# EAGLE design GuardDog (EAGLE 6.2)
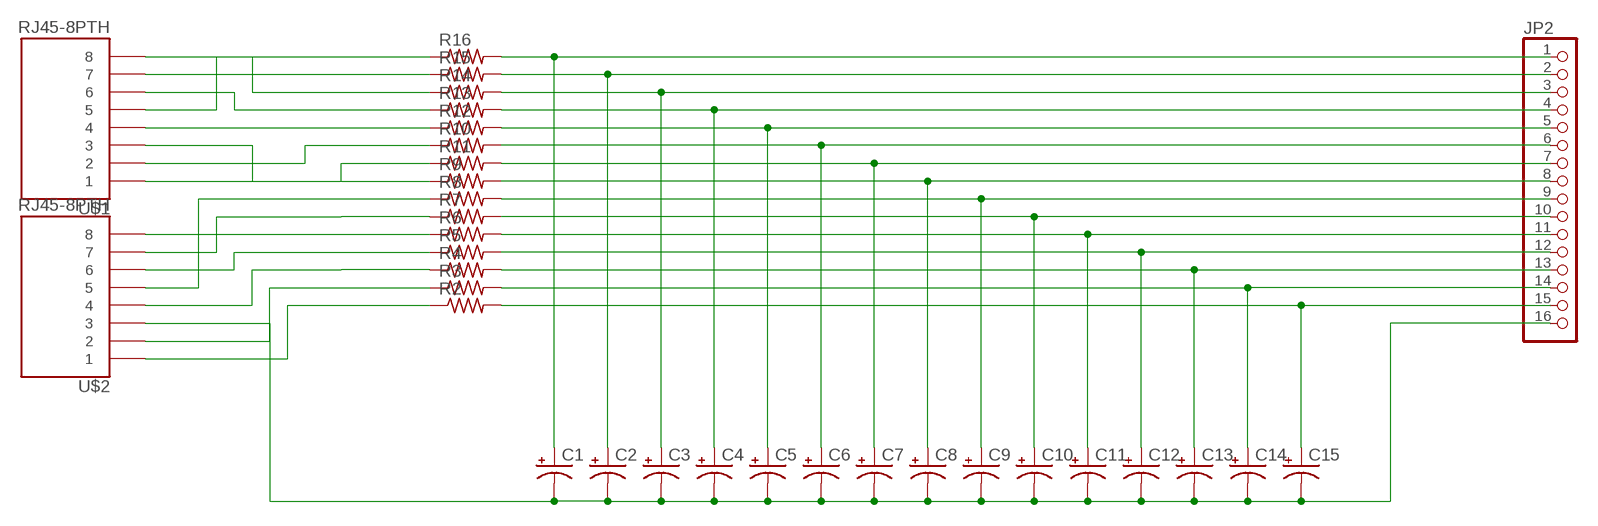
[diagram p0: schematic, sheet 1]

## Parts
C1  CAP_POLPTH2  [CPOL-RADIAL-10UF-25V]
C2  CAP_POLPTH2  [CPOL-RADIAL-10UF-25V]
C3  CAP_POLPTH2  [CPOL-RADIAL-10UF-25V]
C4  CAP_POLPTH2  [CPOL-RADIAL-10UF-25V]
C5  CAP_POLPTH2  [CPOL-RADIAL-10UF-25V]
C6  CAP_POLPTH2  [CPOL-RADIAL-10UF-25V]
C7  CAP_POLPTH2  [CPOL-RADIAL-10UF-25V]
C8  CAP_POLPTH2  [CPOL-RADIAL-10UF-25V]
C9  CAP_POLPTH2  [CPOL-RADIAL-10UF-25V]
C10  CAP_POLPTH2  [CPOL-RADIAL-10UF-25V]
C11  CAP_POLPTH2  [CPOL-RADIAL-10UF-25V]
C12  CAP_POLPTH2  [CPOL-RADIAL-10UF-25V]
C13  CAP_POLPTH2  [CPOL-RADIAL-10UF-25V]
C14  CAP_POLPTH2  [CPOL-RADIAL-10UF-25V]
C15  CAP_POLPTH2  [CPOL-RADIAL-10UF-25V]
JP2  PINHD-1X16  [1X16]
R2  R-US_0204/5  [0204/5]
R3  R-US_0204/5  [0204/5]
R4  R-US_0204/5  [0204/5]
R5  R-US_0204/5  [0204/5]
R6  R-US_0204/5  [0204/5]
R7  R-US_0204/5  [0204/5]
R8  R-US_0204/5  [0204/5]
R9  R-US_0204/5  [0204/5]
R10  R-US_0204/5  [0204/5]
R11  R-US_0204/5  [0204/5]
R12  R-US_0204/5  [0204/5]
R13  R-US_0204/5  [0204/5]
R14  R-US_0204/5  [0204/5]
R15  R-US_0204/5  [0204/5]
R16  R-US_0204/5  [0204/5]
U$1  RJ45-8PTH  [RJ45-8]
U$2  RJ45-8PTH  [RJ45-8]

## Nets
N$1: R15.1 U$1.7
N$2: C2.1(+) JP2.2 R15.2
N$3: R16.1 U$1.5
N$4: C1.1(+) JP2.1 R16.2
N$5: R14.1 U$1.8
N$6: C3.1(+) JP2.3 R14.2
N$7: R13.1 U$1.6
N$8: C4.1(+) JP2.4 R13.2
N$9: R12.1 U$1.4
N$10: C5.1(+) JP2.5 R12.2
N$11: C6.1(+) JP2.6 R10.2
N$12: R10.1 U$1.2
N$14: C7.1(+) JP2.7 R11.2
N$15: C8.1(+) JP2.8 R9.2
N$16: R9.1 U$1.3
N$17: R8.1 U$2.5
N$18: R7.1 U$2.7
N$19: R6.1 U$2.8
N$20: R4.1 U$2.4
N$21: R5.1 U$2.6
N$22: R3.1 U$2.2
N$23: R2.1 U$2.1
N$25: C9.1(+) JP2.9 R8.2
N$26: C10.1(+) JP2.10 R7.2
N$27: C11.1(+) JP2.11 R6.2
N$28: C12.1(+) JP2.12 R5.2
N$29: C13.1(+) JP2.13 R4.2
N$30: C14.1(+) JP2.14 R3.2
N$31: C15.1(+) JP2.15 R2.2
N$34: R11.1 U$1.1
N$36: C1.2(-) C2.2(-) C3.2(-) C4.2(-) C5.2(-) C6.2(-) C7.2(-) C8.2(-) C9.2(-) C10.2(-) C11.2(-) C12.2(-) C13.2(-) C14.2(-) C15.2(-) JP2.16 U$2.3

## Library data of the parts
C1-C15 = SparkFun:CAP_POL: Capacitor Polarized These are standard SMD and PTH capacitors. Normally 10uF, 47uF, and 100uF in electrolytic and tantalum varieties. Always verify the external diameter of the through hole cap, it varies with capacity, voltage, and manufacturer. The EIA devices should be standard.
JP2 = pinhead:PINHD-1X16: PIN HEADER
R2-R16 = resistor:R-US_: RESISTOR, American symbol
U$1 U$2 = SparkFun:RJ45-8: RJ45 Jack Simple RJ45, 8-pin connection - connector for common Cat5, Cat5e, and Cat6 Ethernet cables. Footprint not yet proven in production. Connector sku is PRT-00643; Breakout PCB sku is BOB-00716.

## Net classes
0 default: width 0.203 mm

## Board
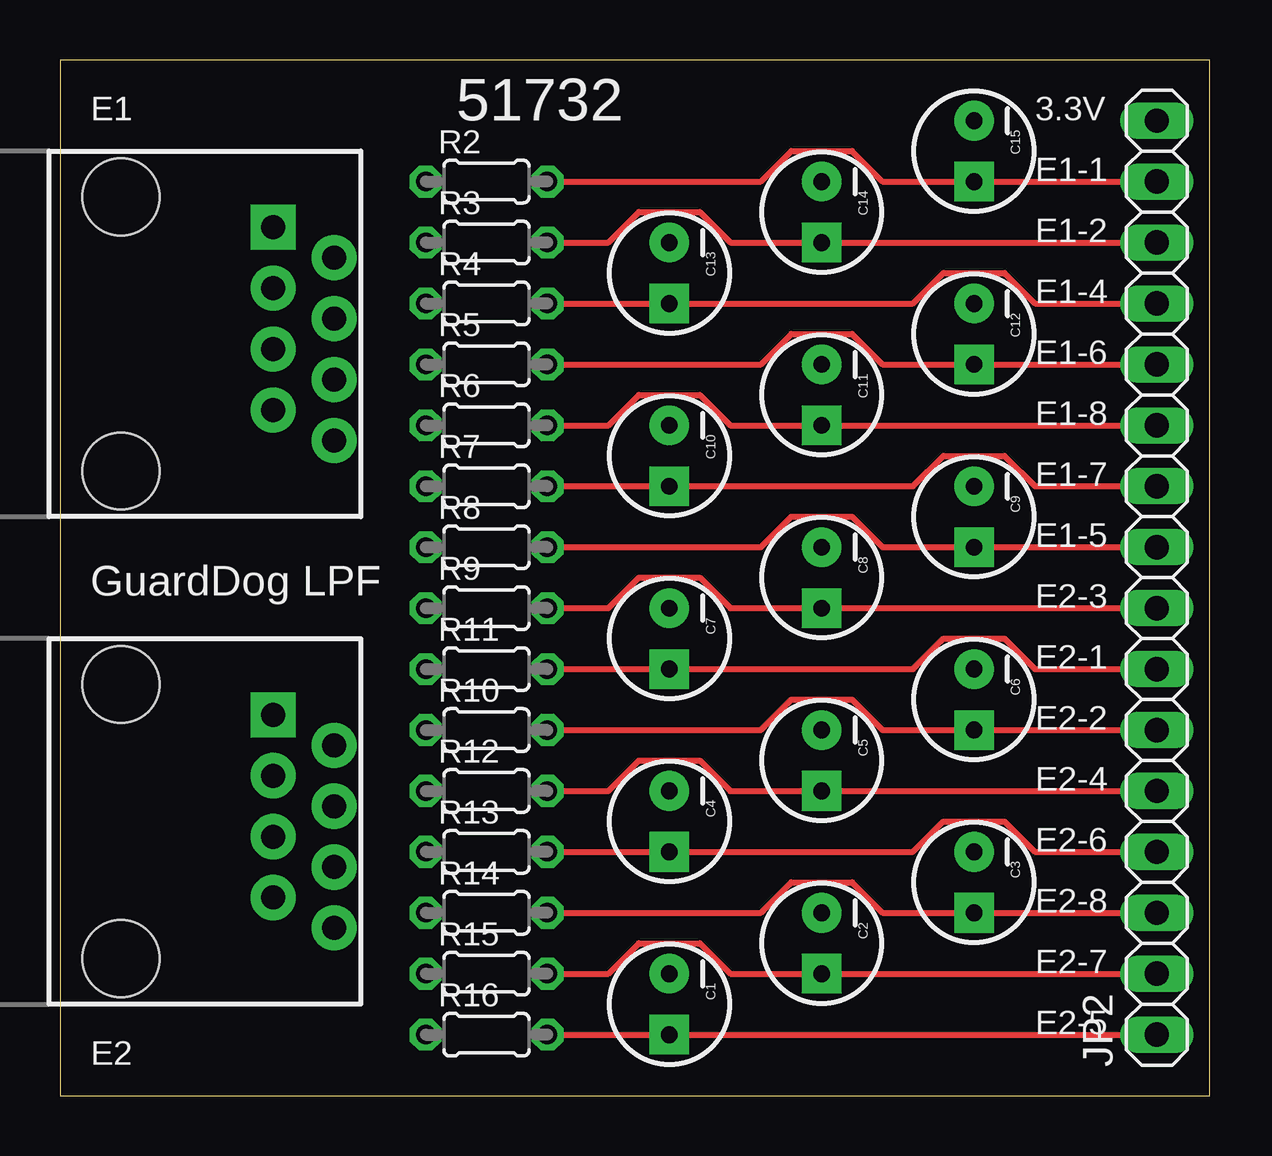
[diagram p1: board, top side]
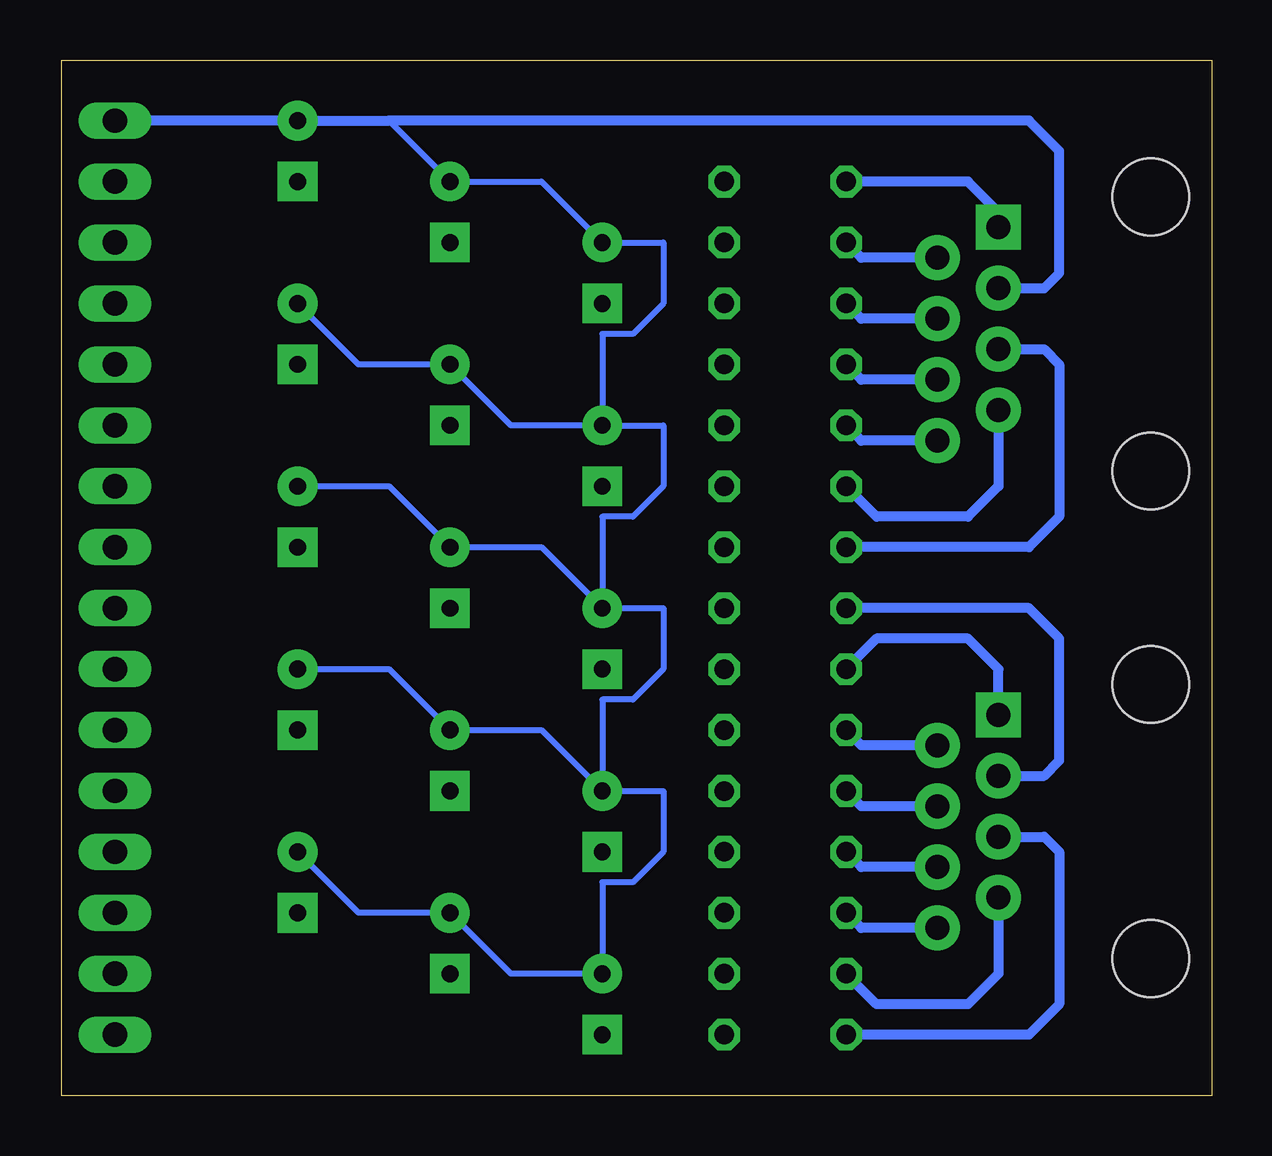
[diagram p2: board, bottom side, seen from below]

Size 47.93 x 43.17 mm. Coordinates in mm from the lower left corner, seen from the top.
Outline: 0,0 47.93,0 47.93,43.17 0,43.17 0,0
Copper layers (1*16): Top 0.035mm / dielectric 1.5mm / Bottom 0.035mm
Design rules: minimum track width 6mil, minimum drill 12mil, track to track 6mil, track to pad 6mil, pad to pad 6mil, via to via 6mil, smd to smd 0mil, copper to edge 10mil, drill to drill 10mil, minimum pad ring 10mil, minimum via ring 6mil, stop-mask expansion 2mil, vias tented up to drill 100mil, thermal gap 10mil

### Footprints (pad centres in the part's own frame; a part is rotated, then mirrored left to right if it is on the bottom)
CPOL-RADIAL-10UF-25V = drill 0.7 pad 1.651 square: 1 1.27,0 | drill 0.7 pad 1.651: 2 -1.27,0
1X16 = drill 1.016 long: 1 -19.05,0; 2 -16.51,0; 3 -13.97,0; 4 -11.43,0; 5 -8.89,0; 6 -6.35,0; 7 -3.81,0; 8 -1.27,0; 9 1.27,0; 10 3.81,0; 11 6.35,0; 12 8.89,0; 13 11.43,0; 14 13.97,0; 15 16.51,0; 16 19.05,0
0204/5 = drill 0.813 octagon: 1 -2.54,0; 2 2.54,0
RJ45-8 = drill 1 pad 1.88 square: 1 -4.445,6.35 | drill 1 pad 1.88: 2 -3.175,8.89; 3 -1.905,6.35; 4 -0.635,8.89; 5 0.635,6.35; 6 1.905,8.89; 7 3.175,6.35; 8 4.445,8.89 | hole 3.2: -5.715,0; 5.715,0

### Placement (x,y rotation side)
C1  25.4,3.81 270 top
C2  31.75,6.35 270 top
C3  38.1,8.89 270 top
C4  25.4,11.43 270 top
C5  31.75,13.97 270 top
C6  38.1,16.51 270 top
C7  25.4,19.05 270 top
C8  31.75,21.59 270 top
C9  38.1,24.13 270 top
C10  25.4,26.67 270 top
C11  31.75,29.21 270 top
C12  38.1,31.75 270 top
C13  25.4,34.29 270 top
C14  31.75,36.83 270 top
C15  38.1,39.37 270 top
JP2  45.72,21.59 90 top
R2  17.78,38.1 0 top
R3  17.78,35.56 0 top
R4  17.78,33.02 0 top
R5  17.78,30.48 0 top
R6  17.78,27.94 0 top
R7  17.78,25.4 0 top
R8  17.78,22.86 0 top
R9  17.78,20.32 0 top
R10  17.78,15.24 0 top
R11  17.78,17.78 0 top
R12  17.78,12.7 0 top
R13  17.78,10.16 0 top
R14  17.78,7.62 0 top
R15  17.78,5.08 0 top
R16  17.78,2.54 0 top
U$1  2.54,11.43 270 top
U$2  2.54,31.75 270 top

### Tracks (layer width: path | path; a pad name or v marks a point on that pad's centre or on a via)
N$1
  Bottom 0.406: U$1.7 8.89,5.08 10.16,3.81 13.97,3.81 R15.1
N$2
  Top 0.254: R15.2 22.86,5.08 24.13,6.35 26.67,6.35 27.94,5.08 C2.1 JP2.2
N$3
  Bottom 0.406: U$1.5 6.99,10.79 6.35,10.16 6.35,3.81 7.62,2.54 R16.1
N$4
  Top 0.254: R16.2 C1.1 JP2.1 46.99,2.54
N$5
  Bottom 0.406: U$1.8 14.61,6.98 R14.1
N$6
  Top 0.254: R14.2 29.21,7.62 30.48,8.89 33.02,8.89 34.29,7.62 C3.1 JP2.3
N$7
  Bottom 0.406: U$1.6 14.61,9.52 R13.1
N$8
  Top 0.254: R13.2 C4.1 35.56,10.16 36.83,11.43 39.37,11.43 40.64,10.16 JP2.4
N$9
  Bottom 0.406: U$1.4 14.61,12.06 R12.1
N$10
  Top 0.254: R12.2 22.86,12.7 24.13,13.97 26.67,13.97 27.94,12.7 C5.1 JP2.5
N$11
  Top 0.254: R10.2 29.21,15.24 30.48,16.51 33.02,16.51 34.29,15.24 C6.1 JP2.6 46.99,15.24
N$12
  Bottom 0.406: U$1.2 14.61,14.6 R10.1
N$14
  Top 0.254: 46.99,17.78 JP2.7 40.64,17.78 39.37,19.05 36.83,19.05 35.56,17.78 C7.1 R11.2
N$15
  Top 0.254: R9.2 22.86,20.32 24.13,21.59 26.67,21.59 27.94,20.32 C8.1 JP2.8
N$16
  Bottom 0.406: U$1.3 6.99,13.34 6.35,13.97 6.35,19.05 7.62,20.32 R9.1
N$17
  Bottom 0.406: U$2.5 6.99,31.11 6.35,30.48 6.35,24.13 7.62,22.86 R8.1
N$18
  Bottom 0.406: U$2.7 8.89,25.4 10.16,24.13 13.97,24.13 R7.1
N$19
  Bottom 0.406: U$2.8 14.61,27.3 R6.1
N$20
  Bottom 0.406: U$2.4 14.61,32.38 R4.1
N$21
  Bottom 0.406: U$2.6 14.61,29.84 R5.1
N$22
  Bottom 0.406: U$2.2 14.61,34.92 R3.1
N$23
  Bottom 0.406: U$2.1 8.89,36.83 10.16,38.1 R2.1
N$25
  Top 0.254: R8.2 29.21,22.86 30.48,24.13 33.02,24.13 34.29,22.86 C9.1 JP2.9
N$26
  Top 0.254: R7.2 C10.1 35.56,25.4 36.83,26.67 39.37,26.67 40.64,25.4 JP2.10
N$27
  Top 0.254: R6.2 22.86,27.94 24.13,29.21 26.67,29.21 27.94,27.94 C11.1 JP2.11
N$28
  Top 0.254: R5.2 29.21,30.48 30.48,31.75 33.02,31.75 34.29,30.48 C12.1 JP2.12
N$29
  Top 0.254: R4.2 C13.1 35.56,33.02 36.83,34.29 39.37,34.29 40.64,33.02 JP2.13
N$30
  Top 0.254: R3.2 22.86,35.56 24.13,36.83 26.67,36.83 27.94,35.56 C14.1 JP2.14
N$31
  Top 0.254: R2.2 29.21,38.1 30.48,39.37 33.02,39.37 34.29,38.1 C15.1 JP2.15
N$34
  Bottom 0.406: U$1.1 8.89,17.78 10.16,19.05 13.97,19.05 R11.1
N$36
  Bottom 0.254: 34.29,40.64 C14.2 27.94,38.1 C13.2 22.86,35.56 22.86,33.02 24.13,31.75 25.4,31.75 C10.2 | C3.2 35.56,7.62 C2.2 29.21,5.08 C1.2 25.4,8.89 24.13,8.89 22.86,10.16 22.86,12.7 C4.2 | C7.2 22.86,20.32 22.86,17.78 24.13,16.51 25.4,16.51 C4.2 | C7.2 27.94,22.86 C8.2 34.29,25.4 C9.2 | C10.2 29.21,27.94 C11.2 35.56,30.48 C12.2 | C10.2 22.86,27.94 22.86,25.4 24.13,24.13 25.4,24.13 C7.2 | C6.2 34.29,17.78 C5.2 27.94,15.24 C4.2
  Bottom 0.406: U$2.3 6.99,33.66 6.35,34.29 6.35,39.37 7.62,40.64 34.29,40.64 C15.2 JP2.16

### Text on the board
tPlace: E1 | 51732 | 3.3V | E1-1 | E1-2 | E1-4 | E1-6 | E1-8 | E1-7 | E1-5 | GuardDog LPF | E2-3 | E2-1 | E2-2 | E2-4 | E2-6 | E2-8 | E2-7 | E2-5 | E2